# EAGLE board SPEEDUINO_WATERPROOF_TC_TRAC (EAGLE 9.1.3), part 1 of 2
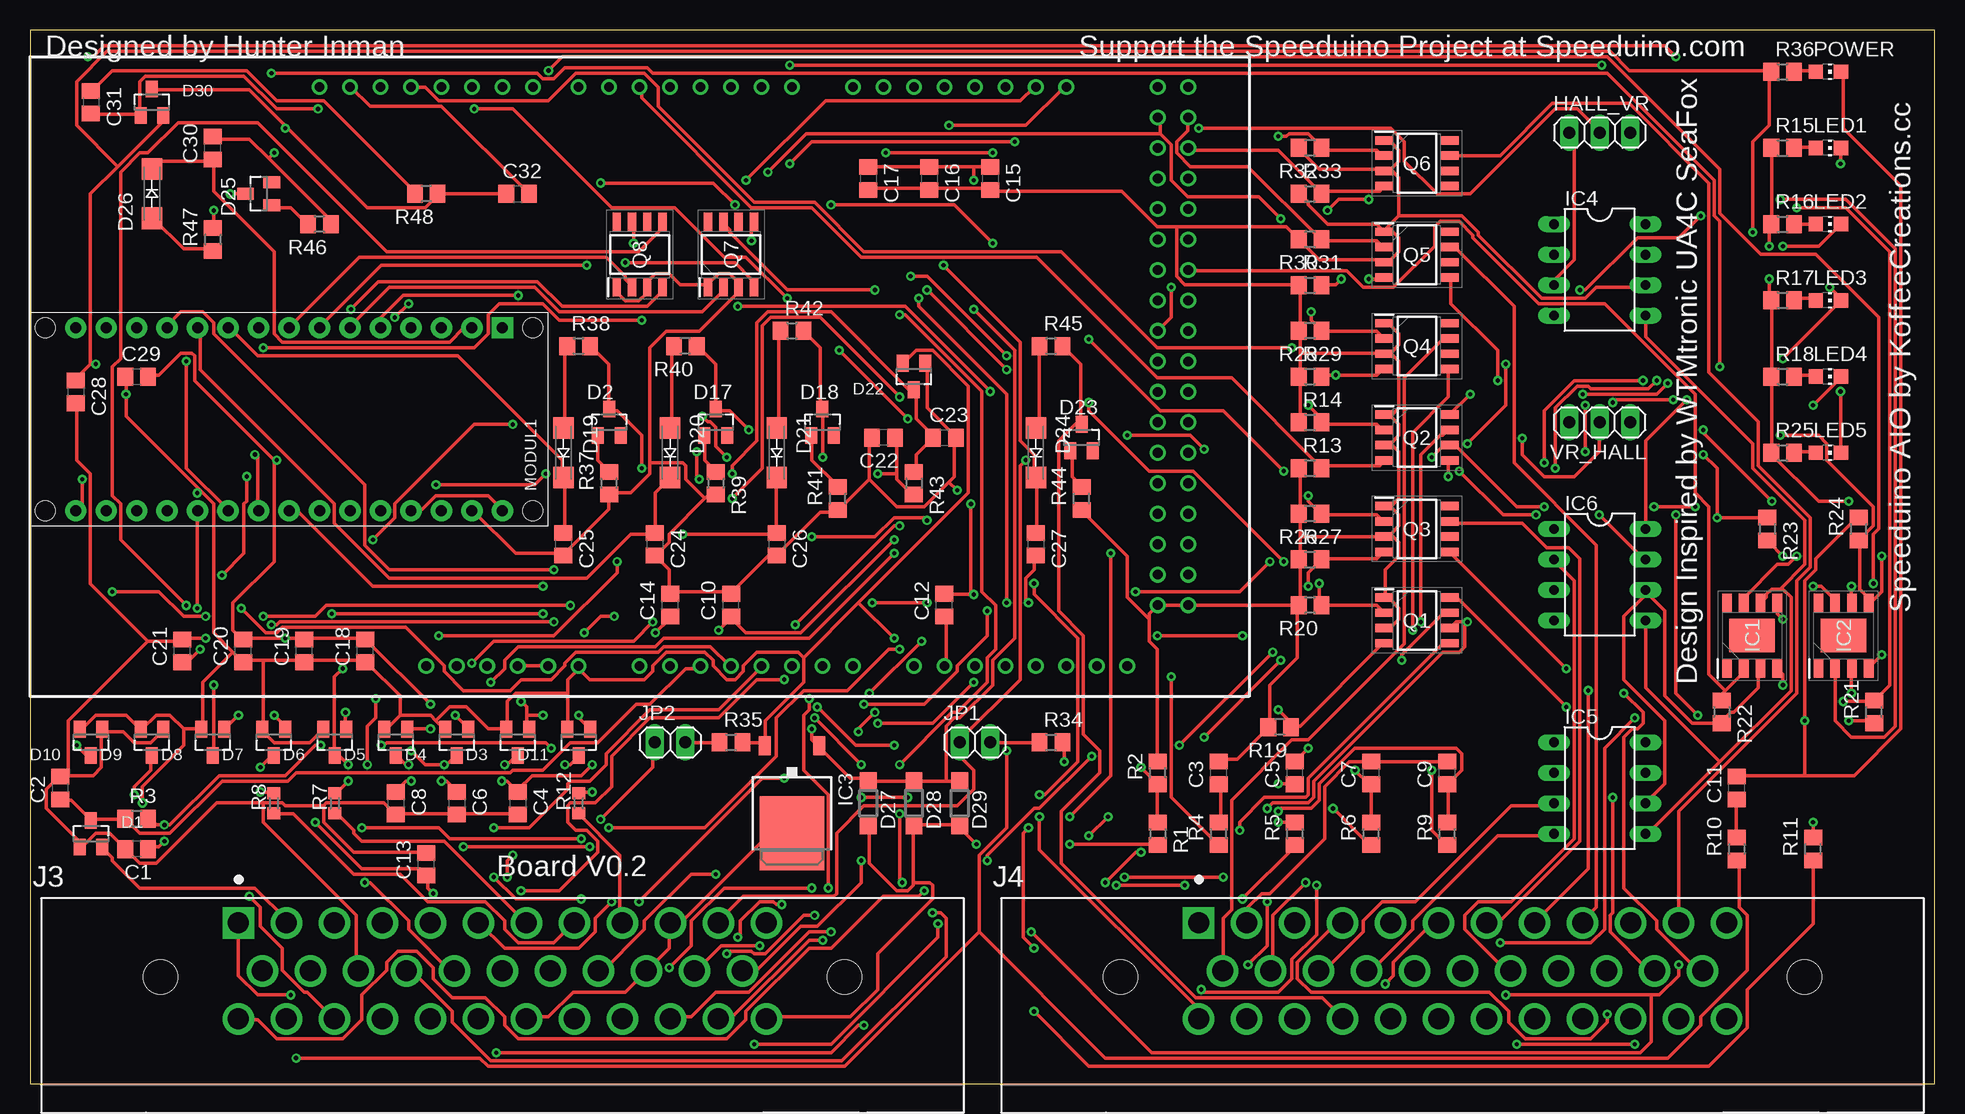
[diagram p6: board, top side]
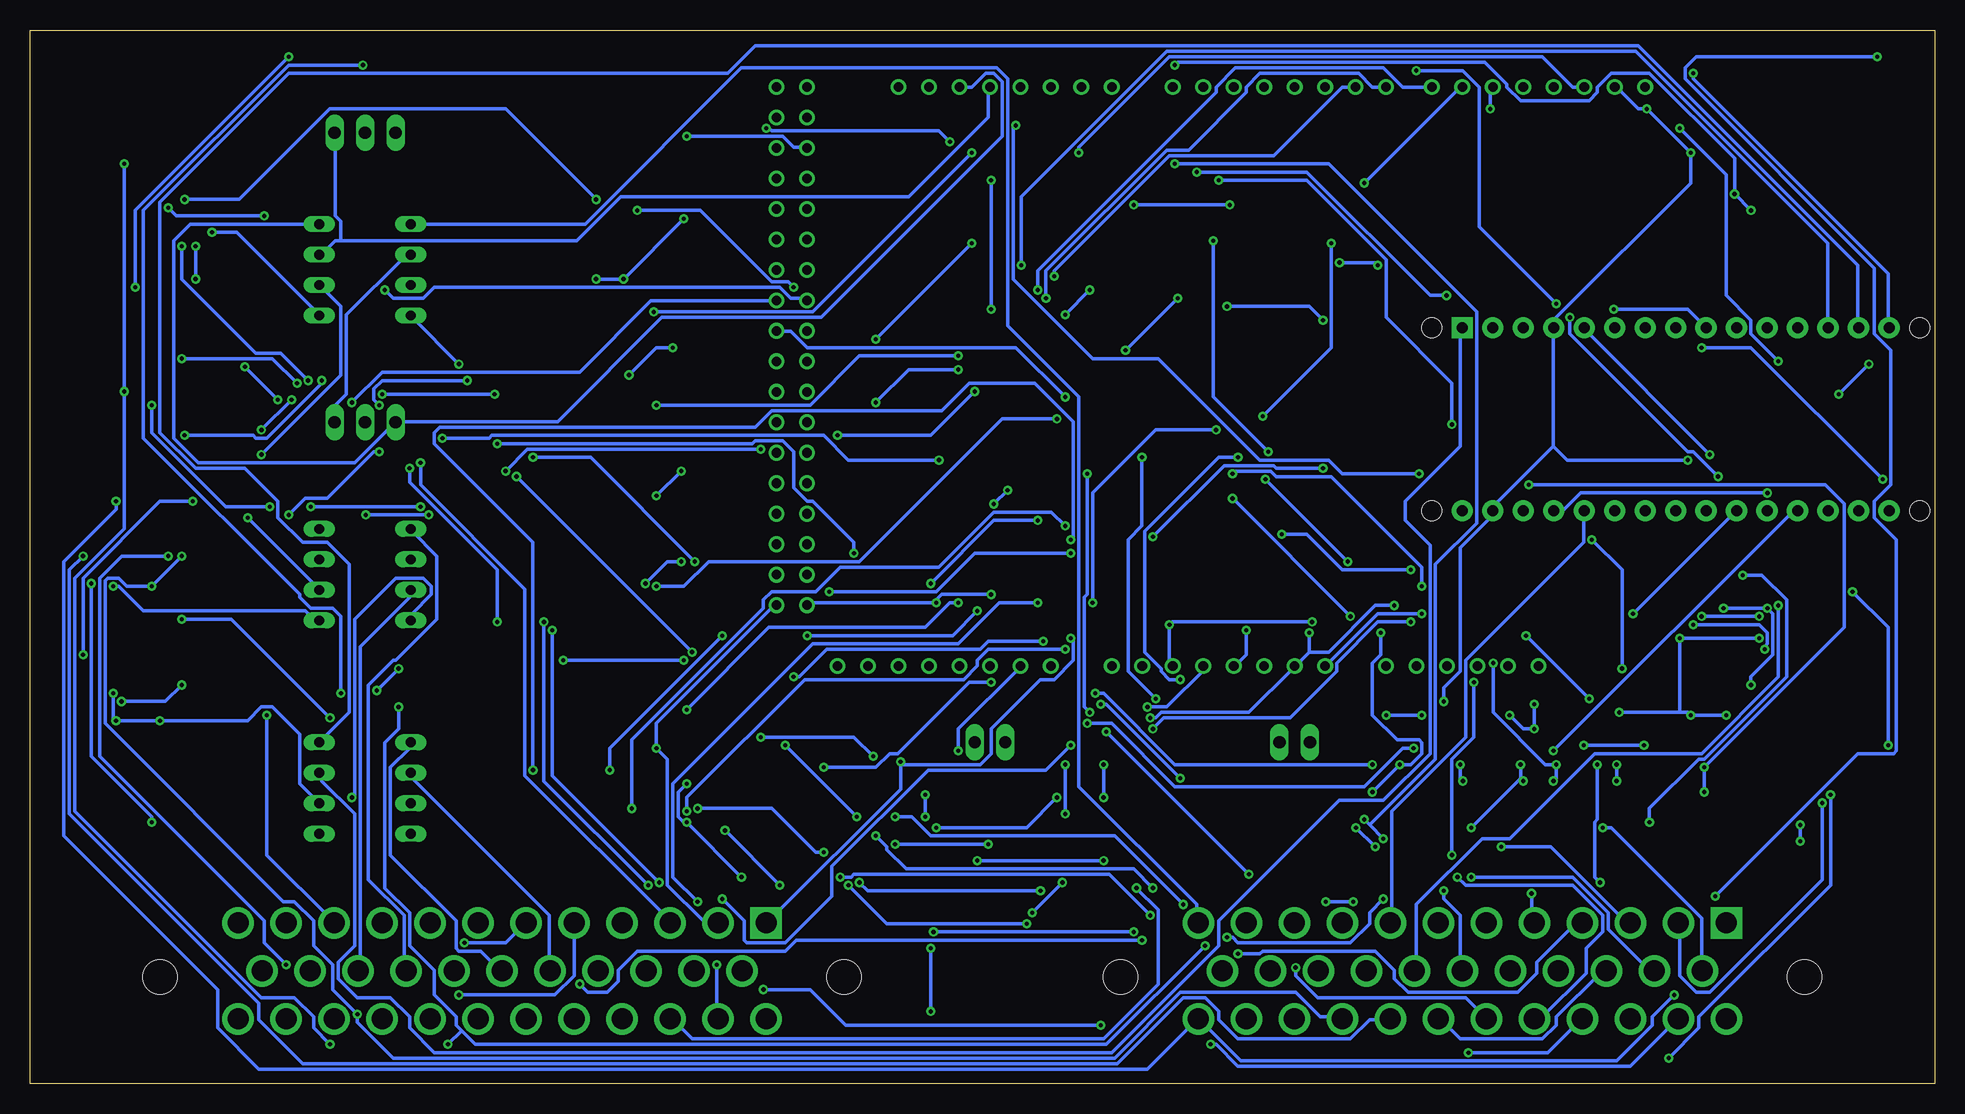
[diagram p7: board, bottom side, seen from below]

Size 158.73 x 87.81 mm. Coordinates in mm from the lower left corner, seen from the top.
Outline: 0,0 158.73,0 158.73,87.81 0,87.81 0,0
Copper layers (1*16): Top 0.035mm / dielectric 1.5mm / Bottom 0.035mm
Design rules "default *": minimum track width 12mil, minimum drill 0.35mm, track to track 6mil, track to pad 6mil, pad to pad 6mil, via to via 6mil, smd to smd 6mil, copper to edge 40mil, drill to drill 6mil, minimum pad ring 10mil, minimum via ring 8mil, stop-mask expansion 4mil, vias tented up to drill 0mil, thermal gap 10mil

## Footprints (pad centres in the part's own frame; a part is rotated, then mirrored left to right if it is on the bottom)
C0805 = smd 1.3 x 1.5: 1 -0.95,0; 2 0.95,0
SOT23 = smd 1 x 1.4: 1 -0.95,-1.1; 2 0.95,-1.1; 3 0,1.1
SMA-DO214AC = smd 1.8 x 1.7: A -2.05,0; K 2.05,0
SOD123 = smd 1.4 x 1.4: A 1.9,0; C -1.9,0
1X03 = drill 1.016 long: 1 -2.54,0; 2 0,0; 3 2.54,0
SOP140P599X142-9N = smd 1.532 x 0.8: 1 -2.734,2.096; 2 -2.734,0.698; 3 -2.734,-0.698; 4 -2.734,-2.096; 5 2.734,-2.096; 6 2.734,-0.698; 7 2.734,0.698; 8 2.734,2.096 | smd 2.794 x 3.81: 9 0,0
TO252 = smd 1 x 1.6: 1 -2.28,-4.8; 2 2.28,-4.8 | smd 5.4 x 6.2: 3 0,2.5
DIL08 = drill 0.813 long: 1 -3.81,-3.81; 2 -1.27,-3.81; 3 1.27,-3.81; 4 3.81,-3.81; 5 3.81,3.81; 6 1.27,3.81; 7 -1.27,3.81; 8 -3.81,3.81
TE_776180-1 = drill 1.75 square: 1 -22,4 | drill 1.75: 2 -18,4; 3 -14,4; 4 -10,4; 5 -6,4; 6 -2,4; 7 2,4; 8 6,4; 9 10,4; 10 14,4; 11 18,4; 12 22,4; 13 -20,0; 14 -16,0; 15 -12,0; 16 -8,0; 17 -4,0; 18 0,0; 19 4,0; 20 8,0; 21 12,0; 22 16,0; 23 20,0; 24 -22,-4; 25 -18,-4; 26 -14,-4; 27 -10,-4; 28 -6,-4; 29 -2,-4; 30 2,-4; 31 6,-4; 32 10,-4; 33 14,-4; 34 18,-4; 35 22,-4 | hole 2.85: -28.5,-0.5; 28.5,-0.5
1X02 = drill 1.016 long: 1 -1.27,0; 2 1.27,0
CHIP-LED0805 = smd 1.2 x 1.2: A 0,-1.05; C 0,1.05
ARDUINO_NANO2 = drill 0.914 pad 1.778 square: J1.1 -7.62,17.78 | drill 0.914 pad 1.778: J1.2 -7.62,15.24; J1.3 -7.62,12.7; J1.4 -7.62,10.16; J1.5 -7.62,7.62; J1.6 -7.62,5.08; J1.7 -7.62,2.54; J1.8 -7.62,0; J1.9 -7.62,-2.54; J1.10 -7.62,-5.08; J1.11 -7.62,-7.62; J1.12 -7.62,-10.16; J1.13 -7.62,-12.7; J1.14 -7.62,-15.24; J1.15 -7.62,-17.78; J2.1 7.62,17.78; J2.2 7.62,15.24; J2.3 7.62,12.7; J2.4 7.62,10.16; J2.5 7.62,7.62; J2.6 7.62,5.08; J2.7 7.62,2.54; J2.8 7.62,0; J2.9 7.62,-2.54; J2.10 7.62,-5.08; J2.11 7.62,-7.62; J2.12 7.62,-10.16; J2.13 7.62,-12.7; J2.14 7.62,-15.24; J2.15 7.62,-17.78 | hole 1.651: -7.62,-20.32; 7.62,-20.32; 7.62,20.32; -7.62,20.32
SOIC127P600X175-8N = smd 1.525 x 0.7: 1 -2.712,1.905; 2 -2.712,0.635; 3 -2.712,-0.635; 4 -2.712,-1.905; 5 2.712,-1.905; 6 2.712,-0.635; 7 2.712,0.635; 8 2.712,1.905
R0805 = smd 1.3 x 1.5: 1 -0.95,0; 2 0.95,0
R0603 = smd 1 x 1.1: 1 -0.85,0; 2 0.85,0
MEGAOUTLINE = drill 0.8: 0 12.7,24.13; 1 10.16,24.13; 2 7.62,24.13; 3 5.08,24.13; 3V3 -15.24,-24.13; 4 2.54,24.13; 5 0,24.13; 5V -12.7,-24.13; 6 -2.54,24.13; 7 -5.08,24.13; 8 -8.89,24.13; 9 -11.43,24.13; 10 -13.97,24.13; 11 -16.51,24.13; 12 -19.05,24.13; 13 -21.59,24.13; 14 17.78,24.13; 15 20.32,24.13; 16 22.86,24.13; 17 25.4,24.13; 18 27.94,24.13; 19 30.48,24.13; 20 33.02,24.13; 21 35.56,24.13; 22 43.18,21.59; 23 45.72,21.59; 24 43.18,19.05; 25 45.72,19.05; 26 43.18,16.51; 27 45.72,16.51; 28 43.18,13.97; 29 45.72,13.97; 30 43.18,11.43; 31 45.72,11.43; 32 43.18,8.89; 33 45.72,8.89; 34 43.18,6.35; 35 45.72,6.35; 36 43.18,3.81; 37 45.72,3.81; 38 43.18,1.27; 39 45.72,1.27; 40 43.18,-1.27; 41 45.72,-1.27; 42 43.18,-3.81; 43 45.72,-3.81; 44 43.18,-6.35; 45 45.72,-6.35; 46 43.18,-8.89; 47 45.72,-8.89; 48 43.18,-11.43; 49 45.72,-11.43; 50 43.18,-13.97; 51 45.72,-13.97; 52 43.18,-16.51; 53 45.72,-16.51; A0 0,-24.13; A1 2.54,-24.13; A2 5.08,-24.13; A3 7.62,-24.13; A4 10.16,-24.13; A5 12.7,-24.13; A6 15.24,-24.13; A7 17.78,-24.13; A8 22.86,-24.13; A9 25.4,-24.13; A10 27.94,-24.13; A11 30.48,-24.13; A12 33.02,-24.13; A13 35.56,-24.13; A14 38.1,-24.13; A15 40.64,-24.13; AREF -26.67,24.13; GND@1 -24.13,24.13; GND@2 -10.16,-24.13; GND@3 -7.62,-24.13; GND@4 43.18,24.13; GND@5 45.72,24.13; GND@6 43.18,-19.05; GND@7 45.72,-19.05; RESET -17.78,-24.13; VIN -5.08,-24.13

## Placement (x,y rotation side)
C1  u1  [C0805]  8.89,19.56 180 top
C2  u22  [C0805]  2.54,24.64 90 top
C3  u1  [C0805]  99.06,25.91 90 top
C4  u22  [C0805]  40.64,23.37 270 top
C5  u1  [C0805]  105.41,25.91 90 top
C6  u22  [C0805]  35.56,23.37 270 top
C7  u1  [C0805]  111.76,25.91 90 top
C8  u22  [C0805]  30.48,23.37 270 top
C9  u1  [C0805]  118.11,25.91 90 top
C10  u22  [C0805]  58.42,39.88 90 top
C11  u1  [C0805]  142.24,24.64 90 top
C12  u22  [C0805]  76.2,39.88 90 top
C13  u1  [C0805]  33.02,18.29 90 top
C14  u22  [C0805]  53.34,39.88 90 top
C15  47u  [C0805]  80.01,75.44 270 top
C16  47u  [C0805]  74.93,75.44 270 top
C17  47u  [C0805]  69.85,75.44 270 top
C18  47u  [C0805]  27.94,36.07 90 top
C19  47u  [C0805]  22.86,36.07 90 top
C20  47u  [C0805]  17.78,36.07 90 top
C21  47u  [C0805]  12.7,36.07 90 top
C22  u1  [C0805]  71.12,53.85 180 top
C23  u22  [C0805]  76.2,53.85 0 top
C24  u22  [C0805]  52.07,44.96 270 top
C25  u22  [C0805]  44.45,44.96 270 top
C26  u22  [C0805]  62.23,44.96 270 top
C27  u22  [C0805]  83.82,44.96 270 top
C28  u22  [C0805]  3.81,57.66 270 top
C29  u22  [C0805]  8.89,58.93 0 top
C30  u22  [C0805]  15.24,77.98 90 top
C31  u1  [C0805]  5.08,81.79 270 top
C32  u22  [C0805]  40.64,74.17 0 top
D1  BAT54S  [SOT23]  5.08,20.83 0 top
D2  [SOT23]  48.26,55.12 0 top
D3  BAT54S  [SOT23]  40.64,28.45 180 top
D4  BAT54S  [SOT23]  35.56,28.45 180 top
D5  BAT54S  [SOT23]  30.48,28.45 180 top
D6  BAT54S  [SOT23]  25.4,28.45 180 top
D7  BAT54S  [SOT23]  20.32,28.45 180 top
D8  BAT54S  [SOT23]  15.24,28.45 180 top
D9  BAT54S  [SOT23]  10.16,28.45 180 top
D10  BAT54S  [SOT23]  5.08,28.45 180 top
D11  BAT54S  [SOT23]  45.72,28.45 180 top
D17  [SOT23]  57.15,55.12 0 top
D18  [SOT23]  66.04,55.12 0 top
D19  GF1  [SMA-DO214AC]  44.45,52.58 270 top
D20  GF1  [SMA-DO214AC]  53.34,52.58 270 top
D21  GF1  [SMA-DO214AC]  62.23,52.58 270 top
D22  BAT54S  [SOT23]  73.66,58.93 180 top
D23  [SOT23]  87.63,53.85 0 top
D24  GF1  [SMA-DO214AC]  83.82,52.58 270 top
D25  [SOT23]  19.05,74.17 90 top
D26  GF1  [SMA-DO214AC]  10.16,74.17 90 top
D27  [SOD123]  69.85,23.37 270 top
D28  [SOD123]  73.66,23.37 270 top
D29  [SOD123]  77.47,23.37 270 top
D30  BAT54S  [SOT23]  10.16,81.79 0 top
HALL_VR  [1X03]  130.81,79.25 0 top
IC1  IXDN602SI  [SOP140P599X142-9N]  143.51,37.34 90 top
IC2  IXDN602SI  [SOP140P599X142-9N]  151.13,37.34 90 top
IC3  TL750M05CKVURG3  [TO252]  63.5,23.37 180 top
IC4  [DIL08]  130.81,67.82 270 top
IC5  [DIL08]  130.81,24.64 270 top
IC6  [DIL08]  130.81,42.42 270 top
J3  776180-1  [TE_776180-1]  39.37,9.4 0 top
J4  776180-1  [TE_776180-1]  119.38,9.4 0 top
JP1  [1X02]  78.74,28.45 0 top
JP2  [1X02]  53.34,28.45 0 top
LED1  [CHIP-LED0805]  149.86,77.98 270 top
LED2  [CHIP-LED0805]  149.86,71.63 270 top
LED3  [CHIP-LED0805]  149.86,65.28 270 top
LED4  [CHIP-LED0805]  149.86,58.93 270 top
LED5  [CHIP-LED0805]  149.86,52.58 270 top
MODUL1  ARDUINO_NANO2  [ARDUINO_NANO2]  21.59,55.37 270 top
POWER  [CHIP-LED0805]  149.86,84.33 270 top
Q1  NCV8402ADDR2G  [SOIC127P600X175-8N]  115.57,38.61 0 top
Q2  NCV8402ADDR2G  [SOIC127P600X175-8N]  115.57,53.85 0 top
Q3  NCV8402ADDR2G  [SOIC127P600X175-8N]  115.57,46.23 0 top
Q4  NCV8402ADDR2G  [SOIC127P600X175-8N]  115.57,61.47 0 top
Q5  NCV8402ADDR2G  [SOIC127P600X175-8N]  115.57,69.09 0 top
Q6  NCV8402ADDR2G  [SOIC127P600X175-8N]  115.57,76.71 0 top
Q7  NCV8402ADDR2G  [SOIC127P600X175-8N]  58.42,69.09 90 top
Q8  NCV8402ADDR2G  [SOIC127P600X175-8N]  50.8,69.09 90 top
R1  3K  [R0805]  93.98,20.83 270 top
R2  1K  [R0805]  93.98,25.91 90 top
R3  470  [R0805]  8.89,22.1 0 top
R4  470  [R0805]  99.06,20.83 90 top
R5  470  [R0805]  105.41,20.83 90 top
R6  470  [R0805]  111.76,20.83 90 top
R7  470  [R0603]  25.4,23.37 90 top
R8  470  [R0603]  20.32,23.37 90 top
R9  470  [R0805]  118.11,20.83 90 top
R10  470  [R0805]  142.24,19.56 90 top
R11  470  [R0805]  148.59,19.56 90 top
R12  470  [R0603]  45.72,23.37 90 top
R13  100K  [R0805]  106.68,51.31 0 top
R14  100K  [R0805]  106.68,55.12 0 top
R15  2K  [R0805]  146.05,77.98 0 top
R16  2K  [R0805]  146.05,71.63 0 top
R17  2K  [R0805]  146.05,65.28 0 top
R18  2K  [R0805]  146.05,58.93 0 top
R19  100K  [R0805]  104.14,29.72 180 top
R20  100k  [R0805]  106.68,39.88 180 top
R21  100K  [R0805]  153.67,30.99 90 top
R22  100K  [R0805]  140.97,30.99 270 top
R23  100K  [R0805]  144.78,46.23 270 top
R24  100K  [R0805]  152.4,46.23 90 top
R25  2K  [R0805]  146.05,52.58 0 top
R26  100K  [R0805]  106.68,47.5 180 top
R27  100K  [R0805]  106.68,43.69 0 top
R28  100K  [R0805]  106.68,62.74 180 top
R29  100K  [R0805]  106.68,58.93 0 top
R30  100K  [R0805]  106.68,70.36 180 top
R31  100K  [R0805]  106.68,66.55 0 top
R32  100K  [R0805]  106.68,77.98 180 top
R33  100K  [R0805]  106.68,74.17 0 top
R34  100K  [R0805]  85.09,28.45 0 top
R35  100K  [R0805]  58.42,28.45 0 top
R36  2K  [R0805]  146.05,84.33 0 top
R37  470  [R0805]  48.26,50.04 90 top
R38  470  [R0805]  45.72,61.47 0 top
R39  470  [R0805]  57.15,50.04 270 top
R40  470  [R0805]  54.61,61.47 180 top
R41  470  [R0805]  67.31,48.77 90 top
R42  470  [R0805]  63.5,62.74 0 top
R43  470  [R0805]  73.66,50.04 270 top
R44  470  [R0805]  87.63,48.77 90 top
R45  470  [R0805]  85.09,61.47 0 top
R46  470  [R0805]  24.13,71.63 180 top
R47  470  [R0805]  15.24,70.36 90 top
R48  470  [R0805]  33.02,74.17 180 top
U$1  MEGA_DEVICE  [MEGAOUTLINE]  50.8,58.93 0 top
VR_HALL  [1X03]  130.81,55.12 180 top